# EAGLE design zero_board (EAGLE 9.6.2)
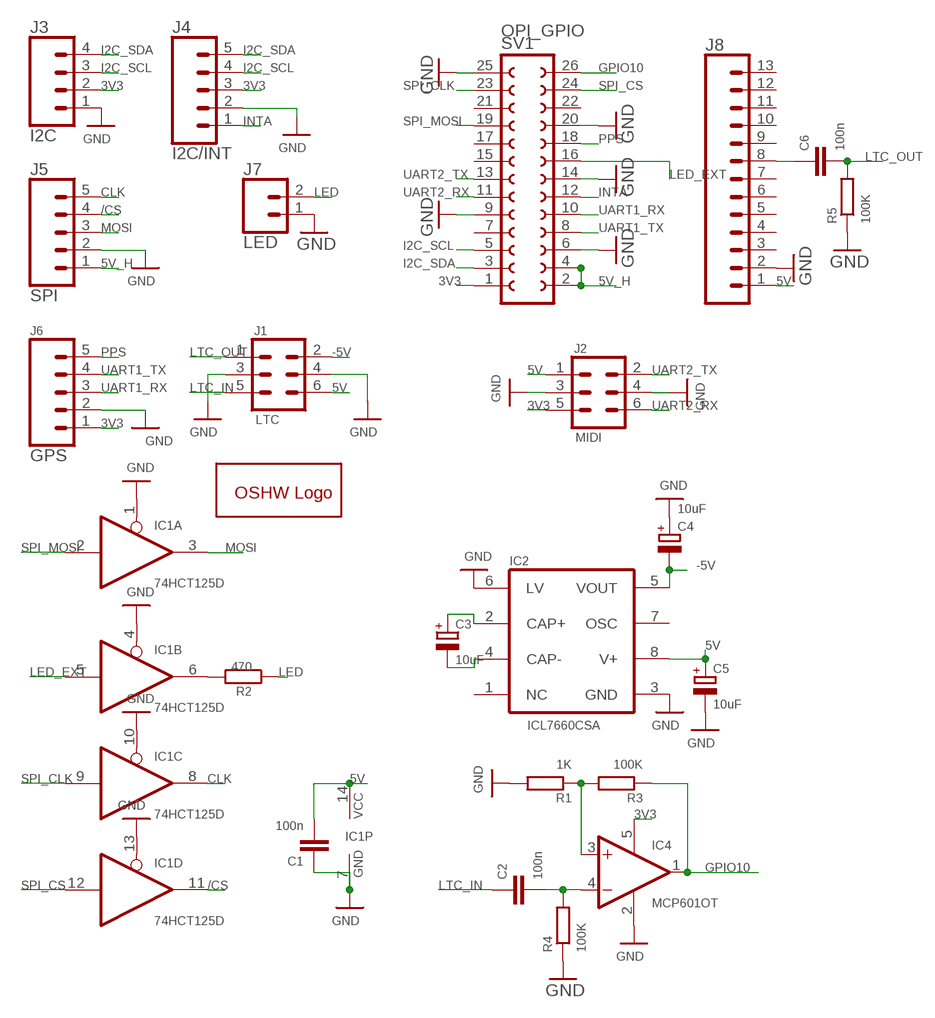
[diagram p0: schematic, sheet 1]

## Parts
C1  100n  C-EUC0603  [C0603]
C2  100n  C-EUC0603  [C0603]
C3  10uF  CPOL-EU153CLV-0405  [153CLV-0405]
C4  10uF  CPOL-EU153CLV-0405  [153CLV-0405]
C5  10uF  CPOL-EU153CLV-0405  [153CLV-0405]
C6  100n  C-EUC0603  [C0603]
GOLD_ORB_SM1  OSHWLOGOLOGO5MM  [OSHW_5MM]
IC1  74HCT125D  [SO14]
IC2  ICL7660CSA  [SO08]
IC4  MCP601OT  [SOT23-5]
J1  LTC  CONN_03X22X3_SILK_MALE_PTH  [2X3]
J2  MIDI  CONN_03X2SHROUD  [2X3-SHROUDED]
J3  I2C  CONN_04  [1X04]
J4  I2C/INT  CONN_05  [1X05]
J5  SPI  CONN_05  [1X05]
J6  GPS  CONN_05  [1X05]
J7  LED  CONN_02  [1X02]
J8  CONN_13  [1X13]
R1  1K  R-EU_R0603  [R0603]
R2  470  R-EU_R0603  [R0603]
R3  100K  R-EU_R0603  [R0603]
R4  100K  R-EU_R0603  [R0603]
R5  100K  R-EU_R0603  [R0603]
SV1  OPI_GPIO  FE13-2  [FE13-2]

## Nets
3V3: IC4.5(V+) J2.5 J3.2 J4.3 J6.1 SV1.1
5V: C1.2 C5.+ IC1.14(P:VCC) IC2.8(V+) J1.6 J2.1 J8.1
5V_H: J5.1 SV1.2 SV1.4
-5V: C4.- IC2.5(VOUT) J1.2
/CS: IC1.11(D:O) J5.4
CLK: IC1.8(C:O) J5.5
GND: C1.1 C4.+ C5.- IC1.1(A:OE) IC1.4(B:OE) IC1.7(P:GND) IC1.10(C:OE) IC1.13(D:OE) IC2.3(GND) IC2.6(LV) IC4.2(V-) J1.3 J1.4 J2.3 J2.4 J3.1 J4.2 J5.2 J6.2 J7.1 J8.2 R1.2 R4.1 R5.1 SV1.6 SV1.9 SV1.14 SV1.20 SV1.25
GPIO10: IC4.1(OUT) R3.1 SV1.26
I2C_SCL: J3.3 J4.4 SV1.5
I2C_SDA: J3.4 J4.5 SV1.3
INTA: J4.1 SV1.12
LED: J7.2 R2.1
LED_EXT: IC1.5(B:I) SV1.16
LINE_OUT_L: C6.1 J8.8
LTC_IN: C2.1 J1.5
LTC_OUT: C6.2 J1.1 R5.2
MOSI: IC1.3(A:O) J5.3
N$1: IC1.6(B:O) R2.2
N$5: C2.2 IC4.4(-IN) R4.2
N$6: IC4.3(+IN) R1.1 R3.2
N$40: C3.+ IC2.2(CAP+)
N$41: C3.- IC2.4(CAP-)
PPS: J6.5 SV1.18
SPI_CLK: IC1.9(C:I) SV1.23
SPI_CS: IC1.12(D:I) SV1.24
SPI_MOSI: IC1.2(A:I) SV1.19
UART1_RX: J6.3 SV1.10
UART1_TX: J6.4 SV1.8
UART2_RX: J2.6 SV1.11
UART2_TX: J2.2 SV1.13
Unconnected: IC2.1(NC) IC2.7(OSC) J8.3 J8.4 J8.5 J8.6 J8.7 J8.9 J8.10 J8.11 J8.12 J8.13 SV1.7 SV1.15 SV1.17 SV1.21 SV1.22

## Library data of the parts
C1 C2 C6 = rcl:C-EU: CAPACITOR, European symbol; SPICEPREFIX: C
C3-C5 = resistor:CPOL-EU: POLARIZED CAPACITOR, European symbol
GOLD_ORB_SM1 = oshw:OSHWLOGO: The OSHW logo for PCB layout
IC1 = 74xx-eu:74*125: Quad bus BUFFER, 3-state
IC2 = maxim:ICL7660CSA: VOLTAGE CONVERTER; MF: MAXIM; MPN: ICL7660CSA; OC_FARNELL: 9724710; OC_NEWARK: 34C3732
IC4 = linear:MCP601: Single Op Amp 2.7V to 6.0V Single Supply CMOS Source: http://ww1.microchip.com/downloads/en/DeviceDoc/21314g.pdf
J1 = SparkFun-Connectors:CONN_03X2: Multi connection point. Often used as Generic Header-pin footprint for 0.1 inch spaced/style header connections You can populate with any combo of single row headers, but if you'd like an exact match, check these: Header - 2x3 (Male, 0.1") <https://www.sparkfun.com/products/12807> (PRT-12807) Header - 2x3 (Female, 0.1") <https://www.sparkfun.com/products/13010> (PRT-13010) 2x3 Pin Shrouded Header <https://www.sparkfun.com/products/10877> (PRT-10877) On any of the 0.1 inch spaced packages, you can populate with these: Break Away Headers - Straight <https://www.sparkfun.com/products/116> (PRT-00116) Break Away Male Headers - Right Angle <https://www.sparkfun.com/products/553> (PRT-00553) Female Headers <https://www.sparkfun.com/products/115> (PRT-00115) Break Away Headers - Machine Pin <https://www.sparkfun.com/products/117> (PRT-00117) Break Away Female Headers - Swiss Machine Pin <https://www.sparkfun.com/products/743> (PRT-00743) Special note: the shrouded connector mates well with our 3x2 ribbon cables: Ribbon Crimp Connector - 6-pin (2x3, Female) <https://www.sparkfun.com/products/10651> (PRT-10651) Ribbon Cable - 6 wire (15ft) <https://www.sparkfun.com/products/10646> (PRT-10646); PROD_ID: CONN-09701
J2 = SparkFun-Connectors:CONN_03X2: Multi connection point. Often used as Generic Header-pin footprint for 0.1 inch spaced/style header connections You can populate with any combo of single row headers, but if you'd like an exact match, check these: Header - 2x3 (Male, 0.1") <https://www.sparkfun.com/products/12807> (PRT-12807) Header - 2x3 (Female, 0.1") <https://www.sparkfun.com/products/13010> (PRT-13010) 2x3 Pin Shrouded Header <https://www.sparkfun.com/products/10877> (PRT-10877) On any of the 0.1 inch spaced packages, you can populate with these: Break Away Headers - Straight <https://www.sparkfun.com/products/116> (PRT-00116) Break Away Male Headers - Right Angle <https://www.sparkfun.com/products/553> (PRT-00553) Female Headers <https://www.sparkfun.com/products/115> (PRT-00115) Break Away Headers - Machine Pin <https://www.sparkfun.com/products/117> (PRT-00117) Break Away Female Headers - Swiss Machine Pin <https://www.sparkfun.com/products/743> (PRT-00743) Special note: the shrouded connector mates well with our 3x2 ribbon cables: Ribbon Crimp Connector - 6-pin (2x3, Female) <https://www.sparkfun.com/products/10651> (PRT-10651) Ribbon Cable - 6 wire (15ft) <https://www.sparkfun.com/products/10646> (PRT-10646); PROD_ID: CONN-10681; SF_ID: PRT_10877
J3 = SparkFun-Connectors:CONN_04: Multi connection point. Often used as Generic Header-pin footprint for 0.1 inch spaced/style header connections On any of the 0.1 inch spaced packages, you can populate with these: Break Away Headers - Straight <https://www.sparkfun.com/products/116> (PRT-00116) Break Away Male Headers - Right Angle <https://www.sparkfun.com/products/553> (PRT-00553) Female Headers <https://www.sparkfun.com/products/115> (PRT-00115) Break Away Headers - Machine Pin <https://www.sparkfun.com/products/117> (PRT-00117) Break Away Female Headers - Swiss Machine Pin <https://www.sparkfun.com/products/743> (PRT-00743) For SCREWTERMINALS and SPRING TERMINALS visit here: Screw Terimnals on SparkFun.com <https://www.sparkfun.com/search/results?term=Screw+Terminals> (5mm/3.5mm/2.54mm spacing) This device is also useful as a general connection point to wire up your design to another part of your project. Our various solder wires solder well into these plated through hole pads. Hook-Up Wire - Assortment (Stranded, 22 AWG) <https://www.sparkfun.com/products/11375> (PRT-11375) Hook-Up Wire - Assortment (Solid Core, 22 AWG) <https://www.sparkfun.com/products/11367> (PRT-11367) View the entire wire category on our website here <https://www.sparkfun.com/categories/141> Special notes: Molex polarized connector foot print use with SKU : PRT-08231 with associated crimp pins and housings. 1MM SMD Version SKU: PRT-10208; PROD_ID: CONN-09696
J4-J6 = SparkFun-Connectors:CONN_05: Multi connection point. Often used as Generic Header-pin footprint for 0.1 inch spaced/style header connections On any of the 0.1 inch spaced packages, you can populate with these: Break Away Headers - Straight <https://www.sparkfun.com/products/116> (PRT-00116) Break Away Male Headers - Right Angle <https://www.sparkfun.com/products/553> (PRT-00553) Female Headers <https://www.sparkfun.com/products/115> (PRT-00115) Break Away Headers - Machine Pin <https://www.sparkfun.com/products/117> (PRT-00117) Break Away Female Headers - Swiss Machine Pin <https://www.sparkfun.com/products/743> (PRT-00743) For SCREWTERMINALS and SPRING TERMINALS visit here: Screw Terimnals on SparkFun.com <https://www.sparkfun.com/search/results?term=Screw+Terminals> (5mm/3.5mm/2.54mm spacing) This device is also useful as a general connection point to wire up your design to another part of your project. Our various solder wires solder well into these plated through hole pads. Hook-Up Wire - Assortment (Stranded, 22 AWG) <https://www.sparkfun.com/products/11375> (PRT-11375) Hook-Up Wire - Assortment (Solid Core, 22 AWG) <https://www.sparkfun.com/products/11367> (PRT-11367) View the entire wire category on our website here <https://www.sparkfun.com/categories/141> Special notes: Molex polarized connector foot print use with SKU : PRT-08231 with associated crimp pins and housings. 1MM SMD Version SKU: PRT-10208
J7 = SparkFun-Connectors:CONN_02: Multi connection point. Often used as Generic Header-pin footprint for 0.1 inch spaced/style header connections On any of the 0.1 inch spaced packages, you can populate with these: Break Away Headers - Straight <https://www.sparkfun.com/products/116> (PRT-00116) Break Away Male Headers - Right Angle <https://www.sparkfun.com/products/553> (PRT-00553) Female Headers <https://www.sparkfun.com/products/115> (PRT-00115) Break Away Headers - Machine Pin <https://www.sparkfun.com/products/117> (PRT-00117) Break Away Female Headers - Swiss Machine Pin <https://www.sparkfun.com/products/743> (PRT-00743) For SCREWTERMINALS and SPRING TERMINALS visit here: Screw Terimnals on SparkFun.com <https://www.sparkfun.com/search/results?term=Screw+Terminals> (5mm/3.5mm/2.54mm spacing) This device is also useful as a general connection point to wire up your design to another part of your project. Our various solder wires solder well into these plated through hole pads. Hook-Up Wire - Assortment (Stranded, 22 AWG) <https://www.sparkfun.com/products/11375> (PRT-11375) Hook-Up Wire - Assortment (Solid Core, 22 AWG) <https://www.sparkfun.com/products/11367> (PRT-11367) View the entire wire category on our website here <https://www.sparkfun.com/categories/141> Special notes: Molex polarized connector foot print use with: PRT-08233 with associated crimp pins and housings. 2.54_SCREWTERM for use with PRT-10571. 3.5mm Screw Terminal footprints for PRT-08084 5mm Screw Terminal footprints for use with PRT-08432
J8 = SparkFun-Connectors:CONN_13: Multi connection point. Often used as Generic Header-pin footprint for 0.1 inch spaced/style header connections On any of the 0.1 inch spaced packages, you can populate with these: Break Away Headers - Straight <https://www.sparkfun.com/products/116> (PRT-00116) Break Away Male Headers - Right Angle <https://www.sparkfun.com/products/553> (PRT-00553) Female Headers <https://www.sparkfun.com/products/115> (PRT-00115) Break Away Headers - Machine Pin <https://www.sparkfun.com/products/117> (PRT-00117) Break Away Female Headers - Swiss Machine Pin <https://www.sparkfun.com/products/743> (PRT-00743) For SCREWTERMINALS and SPRING TERMINALS visit here: Screw Terimnals on SparkFun.com <https://www.sparkfun.com/search/results?term=Screw+Terminals> (5mm/3.5mm/2.54mm spacing) This device is also useful as a general connection point to wire up your design to another part of your project. Our various solder wires solder well into these plated through hole pads. Hook-Up Wire - Assortment (Stranded, 22 AWG) <https://www.sparkfun.com/products/11375> (PRT-11375) Hook-Up Wire - Assortment (Solid Core, 22 AWG) <https://www.sparkfun.com/products/11367> (PRT-11367) View the entire wire category on our website here <https://www.sparkfun.com/categories/141> Special notes: Molex polarized connector foot print use with SKU : PRT-08231 with associated crimp pins and housings. 1MM SMD Version SKU: PRT-10208 NOTES ON THE VARIANTS LOCK and LOCK_LONGPADS... This footprint was designed to help hold the alignment of a through-hole component (i.e. 6-pin header) while soldering it into place. You may notice that each hole has been shifted either up or down by 0.005 of an inch from it's more standard position (which is a perfectly straight line). This slight alteration caused the pins (the squares in the middle) to touch the edges of the holes. Because they are alternating, it causes a "brace" to hold the component in place. 0.005 has proven to be the perfect amount of "off-center" position when using our standard breakaway headers. Although looks a little odd when you look at the bare footprint, once you have a header in there, the alteration is very hard to notice. Also,if you push a header all the way into place, it is covered up entirely on the bottom side.
R1-R5 = rcl:R-EU_: RESISTOR, European symbol
SV1 = con-lsta:FE13-2: FEMALE HEADER; OC_FARNELL: unknown; OC_NEWARK: unknown

## Board
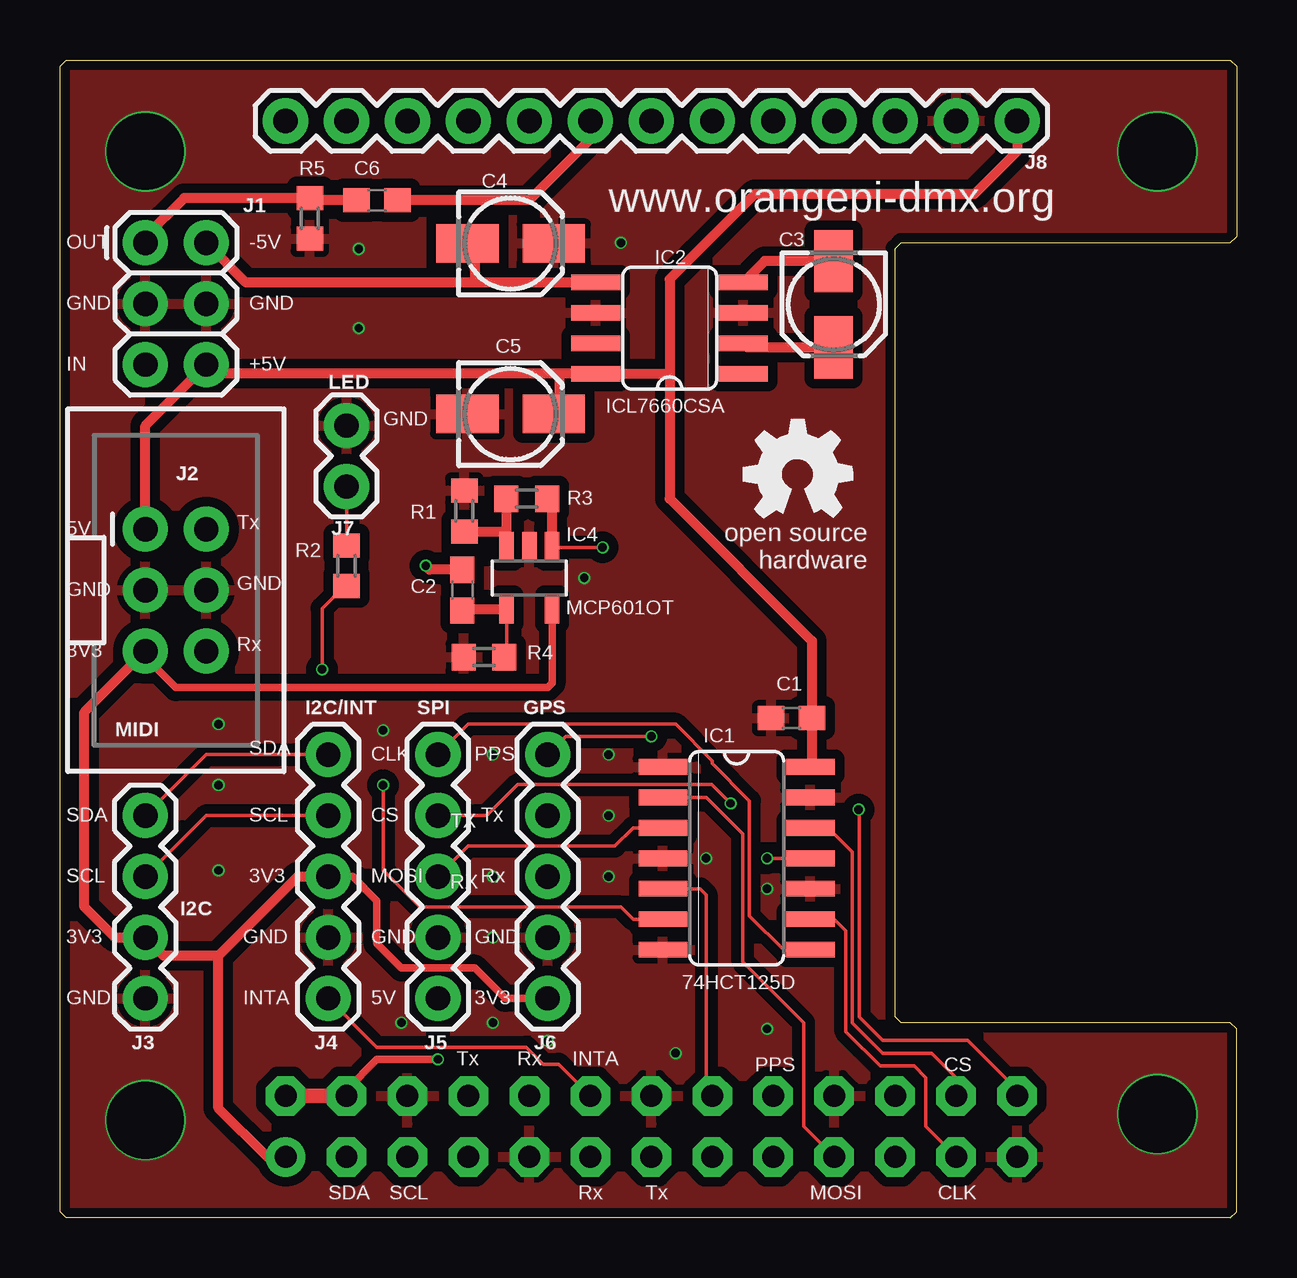
[diagram p1: board, top side]
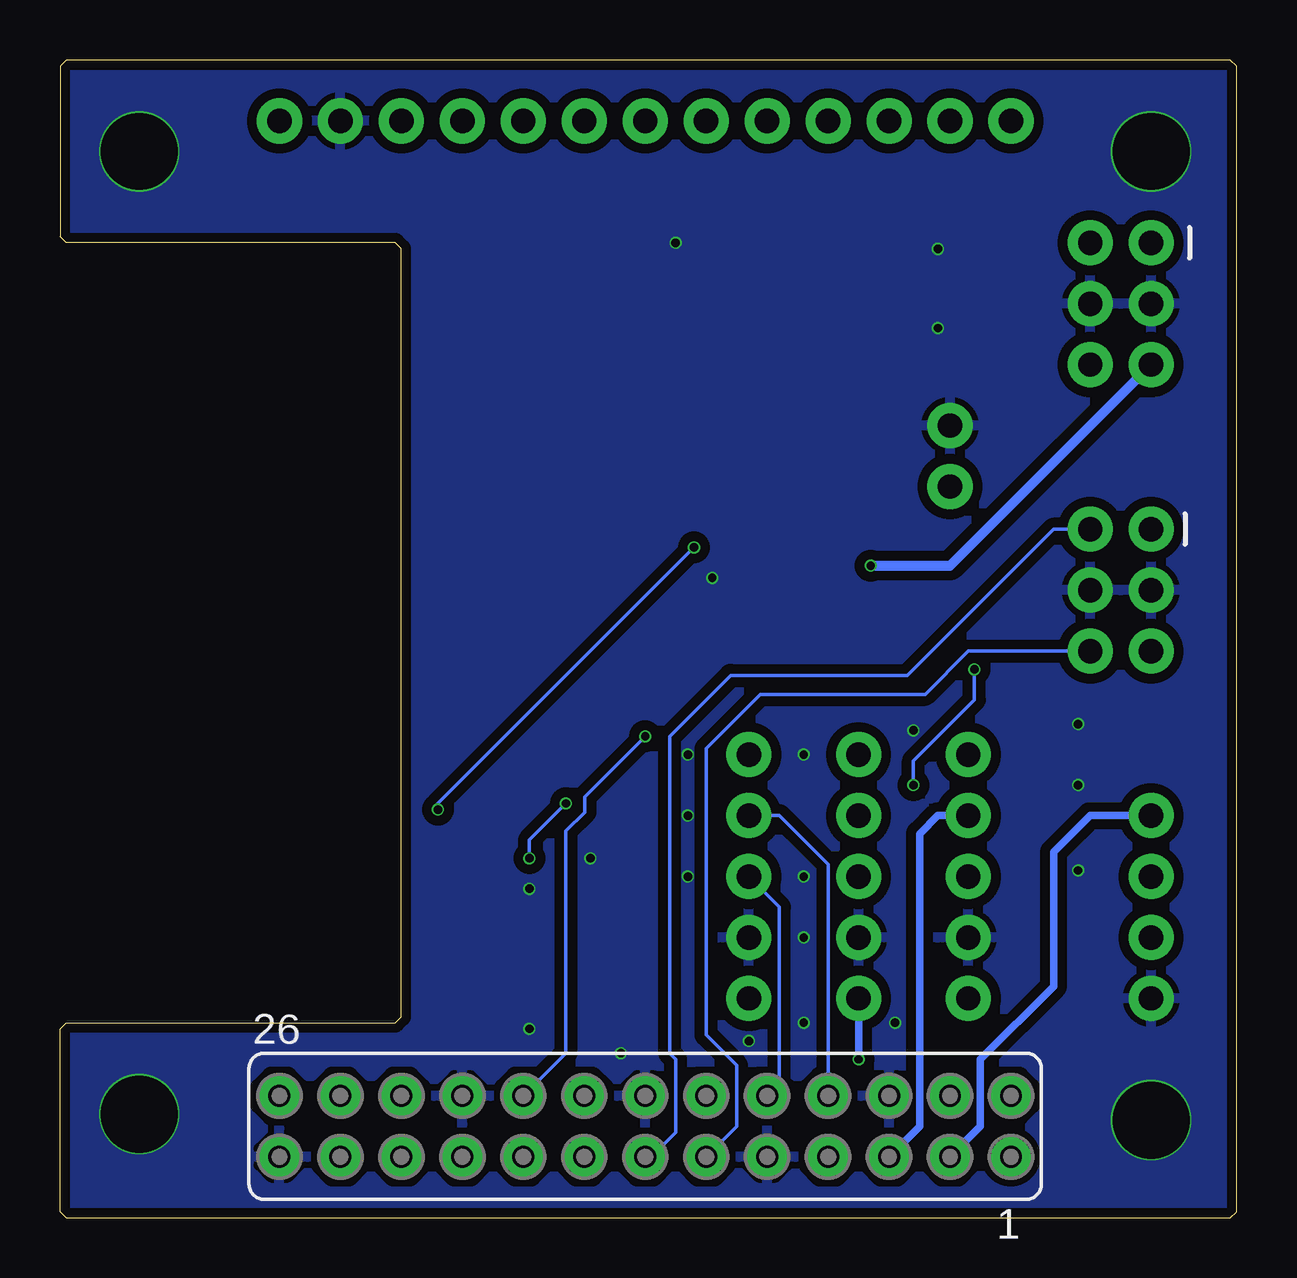
[diagram p2: board, bottom side, seen from below]

Size 49.02 x 48.26 mm. Coordinates in mm from the lower left corner, seen from the top.
Outline: 48.77,0 0.25,0 0,0.25 0,48.01 0.25,48.26 48.77,48.26 49.02,48.01 49.02,40.89 48.77,40.64 35.05,40.64 34.8,40.39 34.8,8.38 35.05,8.13 48.77,8.13 49.02,7.87 49.02,0.25 48.77,0
Copper layers (1*16): Top 0.035mm / dielectric 1.6mm / Bottom 0.035mm
Design rules "jlcpcb-2layers": minimum track width 5mil, minimum drill 0.3mm, track to track 5mil, track to pad 5mil, pad to pad 5mil, via to via 5mil, smd to smd 5mil, copper to edge 0.2mm, drill to drill 6mil, minimum pad ring 10mil, minimum via ring 3mil, stop-mask expansion 4mil, vias tented up to drill 0mil, thermal gap 10mil

### Footprints (pad centres in the part's own frame; a part is rotated, then mirrored left to right if it is on the bottom)
C0603 = smd 1.1 x 1: 1 -0.85,0; 2 0.85,0
153CLV-0405 = smd 2.6 x 1.6: + 1.8,0; - -1.8,0
SO14 = smd 0.66 x 2.032: 1 -3.81,-3.073; 2 -2.54,-3.073; 3 -1.27,-3.073; 4 0,-3.073; 5 1.27,-3.073; 6 2.54,-3.073; 7 3.81,-3.073; 8 3.81,3.073; 9 2.54,3.073; 10 1.27,3.073; 11 0,3.073; 12 -1.27,3.073; 13 -2.54,3.073; 14 -3.81,3.073
SO08 = smd 0.66 x 2.032: 1 -1.905,-3.073; 2 -0.635,-3.073; 3 0.635,-3.073; 4 1.905,-3.073; 5 1.905,3.073; 6 0.635,3.073; 7 -0.635,3.073; 8 -1.905,3.073
SOT23-5 = smd 0.6 x 1.2: 1 -0.95,-1.306; 2 0,-1.306; 3 0.95,-1.306; 4 0.95,1.306; 5 -0.95,1.306
2X3 = drill 1.016 pad 1.88: 1 0,0; 2 0,2.54; 3 2.54,0; 4 2.54,2.54; 5 5.08,0; 6 5.08,2.54
2X3-SHROUDED = drill 1.016 pad 1.88: 1 -1.27,2.54; 2 1.27,2.54; 3 -1.27,0; 4 1.27,0; 5 -1.27,-2.54; 6 1.27,-2.54
1X04 = drill 1.016 pad 1.88: 1 0,0; 2 2.54,0; 3 5.08,0; 4 7.62,0
1X05 = drill 1.016 pad 1.88: 1 0,0; 2 2.54,0; 3 5.08,0; 4 7.62,0; 5 10.16,0
1X02 = drill 1.016 pad 1.88: 1 0,0; 2 2.54,0
1X13 = drill 1.016 pad 1.88: 1 0,0; 2 2.54,0; 3 5.08,0; 4 7.62,0; 5 10.16,0; 6 12.7,0; 7 15.24,0; 8 17.78,0; 9 20.32,0; 10 22.86,0; 11 25.4,0; 12 27.94,0; 13 30.48,0
R0603 = smd 1 x 1.1: 1 -0.85,0; 2 0.85,0
FE13-2 = drill 0.914: 1 -15.24,1.27 | drill 0.914 octagon: 2 -15.24,-1.27; 3 -12.7,1.27; 4 -12.7,-1.27; 5 -10.16,1.27; 6 -10.16,-1.27; 7 -7.62,1.27; 8 -7.62,-1.27; 9 -5.08,1.27; 10 -5.08,-1.27; 11 -2.54,1.27; 12 -2.54,-1.27; 13 0,1.27; 14 0,-1.27; 15 2.54,1.27; 16 2.54,-1.27; 17 5.08,1.27; 18 5.08,-1.27; 19 7.62,1.27; 20 7.62,-1.27; 21 10.16,1.27; 22 10.16,-1.27; 23 12.7,1.27; 24 12.7,-1.27; 25 15.24,1.27; 26 15.24,-1.27

### Placement (x,y rotation side)
C1  30.48,20.83 0 top
C2  16.76,26.16 270 top
C3  32.24,38.07 270 top
C4  18.77,40.61 0 top
C5  18.77,33.5 0 top
C6  13.21,42.42 180 top
GOLD_ORB_SM1  30.73,30.99 0 top
IC1  28.19,14.99 270 top
IC2  25.4,37.08 90 top
IC4  19.56,26.67 180 top
J1  3.56,40.64 270 top
J2  4.83,26.16 0 top
J3  3.56,9.14 90 top
J4  11.18,9.14 90 top
J5  15.75,9.14 90 top
J6  20.32,9.14 90 top
J7  11.94,33.02 270 top
J8  39.88,45.72 180 top
R1  16.85,29.46 90 top
R2  11.94,27.18 270 top
R3  19.45,29.97 180 top
R4  17.67,23.37 0 top
R5  10.41,41.66 90 top
SV1  24.64,3.81 180 bottom

### Tracks (layer width: path | path; a pad name or v marks a point on that pad's centre or on a via)
3V3
  Top 0.305: J6.1 18.54,9.14 17.27,10.41 14.22,10.41 13.21,11.43 13.21,13.21 12.19,14.22 J4.3 | IC4.5 20.51,22.29 20.32,22.1 4.83,22.1 3.56,23.37 J2.5
  Top 0.406: 6.6,10.92 9.91,14.22 J4.3 | SV1.1 8.64,2.54 6.6,4.57 6.6,10.92 | 6.6,10.92 4.32,10.92 J3.2 2.29,11.68 1.02,12.95 1.02,21.08 J2.5
5V
  Top 0.152: 31.33,18.86 IC1.14
  Top 0.406: 31.33,18.86 C1.2 31.33,24.04 25.4,29.97 25.4,35.31 | 25.4,35.31 25.4,39.12 28.96,42.67 38.1,42.67 39.88,44.45 J8.1 | 20.83,35.18 IC2.8 25.27,35.18 25.4,35.31 | 20.83,35.18 6.48,35.18 J1.6 3.56,33.02 J2.1 | C5.+ 20.83,33.76 20.83,35.18
5V_H  (via drill 0.35)
  Top 0.305: SV1.4 11.94,5.33 13.21,6.6 v15.75,6.6
  Top 0.61: SV1.4 SV1.2
  Bottom 0.305: v15.75,6.6 J5.1
-5V
  Top 0.406: IC2.5 17.27,38.99 | 17.27,38.99 7.75,38.99 J1.2 | C4.- 17.27,40.32 17.27,38.99
/CS  (via drill 0.35)
  Top 0.152: v29.46,14.99 IC1.11 | J5.4 17.78,16.76 19.07,18.06 27.15,18.06 v27.94,17.27
  Bottom 0.152: v27.94,17.27 29.46,15.75 v29.46,14.99
CLK
  Top 0.152: IC1.8 31.24,11.15 30.17,11.15 28.73,12.59 28.73,17.38 27.18,18.93 27.18,19.05 25.65,20.57 17.02,20.57 J5.5
GND  (via drill 0.35, 3.2)
  other vias: 3.56,4.06 45.72,4.32 3.56,44.45 45.72,44.45 6.6,14.48 6.6,18.03 25.65,6.86 22.86,16.76 22.86,19.3 21.84,26.67 20.32,7.37 12.45,37.08 6.6,20.57 22.86,14.22 29.46,7.87 29.46,13.72 26.92,14.99 18.03,11.68 14.22,8.13 18.03,8.13 18.03,14.22 13.46,20.32 18.03,19.3 12.45,40.39 23.37,40.64
  pour Bottom (isolate 0.406): 49.78,-1.02 -1.27,-1.02 -1.27,49.53 49.53,49.53 49.53,40.13 36.07,40.13 36.07,8.64 49.78,8.64
  pour Top (isolate 0.406): 49.78,-1.02 49.78,8.64 36.07,8.64 36.07,40.13 49.53,40.13 49.53,49.53 -1.27,49.53 -1.27,-1.02
GPIO10  (via drill 0.35)
  Top 0.152: 20.51,29.76 R3.1 | IC4.1 20.54,27.94 v22.61,27.94 | v33.27,17.02 33.3,17.02 33.3,8.38 34.29,7.39 37.82,7.39 39.88,5.33 SV1.26
  Top 0.406: IC4.1 20.51,29.76
  Bottom 0.152: v33.27,17.02 33.27,17.27 v22.61,27.94
I2C_SCL
  Top 0.152: J3.3 6.1,16.76 J4.4
  Bottom 0.305: SV1.5 13.21,3.81 13.21,16 12.45,16.76 J4.4
I2C_SDA
  Top 0.152: J3.4 6.1,19.3 J4.5
  Bottom 0.305: SV1.3 10.67,3.81 10.67,6.6 7.62,9.65 7.62,15.24 6.1,16.76 J3.4
INTA
  Top 0.152: J4.1 13.21,7.11 19.42,7.11 20.13,6.4 20.77,6.4 SV1.12
LED
  Top 0.152: R2.1 J7.2
LED_EXT
  Top 0.152: SV1.16 26.92,5.33 26.92,13.46 26.67,13.72 IC1.5
LINE_OUT_L
  Top 0.406: C6.1 19.56,42.42 22.1,44.96 J8.8
LTC_IN  (via drill 0.35)
  Top 0.406: C2.1 15.41,27.01 v15.24,27.18
  Bottom 0.406: v15.24,27.18 11.94,27.18 J1.5
LTC_OUT
  Top 0.406: C6.2 10.5,42.42 R5.2 5.17,42.51 3.56,40.89 J1.1
MOSI
  Top 0.152: J5.3 17.02,15.49 23.11,15.49 23.88,16.26 IC1.3
N$1  (via drill 0.35)
  Top 0.152: IC1.6 23.88,12.45 23.37,12.95 14.99,12.95 13.46,14.48 v13.46,18.03 | R2.2 11.85,26.33 10.92,25.4 v10.92,22.86
  Bottom 0.152: v13.46,18.03 13.46,19.05 10.92,21.59 v10.92,22.86
N$5
  Top 0.152: 16.82,25.36 C2.2 | IC4.4 18.61,23.46 R4.2
  Top 0.406: IC4.4 16.82,25.36
N$6
  Top 0.152: IC4.3 18.61,28.45 18.44,28.61 | 18.61,29.96 R3.2
  Top 0.406: 18.61,28.45 18.61,29.96 | R1.1 18.44,28.61
N$40
  Top 0.152: 28.65,36.27 IC2.2
  Top 0.406: C3.+ 28.65,36.27
N$41
  Top 0.406: C3.- 29.36,39.88 IC2.4
PPS  (via drill 0.35)
  Top 0.152: v24.64,20.07 21.08,20.07 J6.5
  Bottom 0.152: v24.64,20.07 27.15,17.55 27.15,16.9 27.94,16.11 27.94,6.86 SV1.18
SPI_CLK
  Top 0.152: SV1.23 36.07,3.81 36.07,5.84 35.59,6.33 34.17,6.33 32.74,7.76 32.74,11.96 32.26,12.45 IC1.9
SPI_CS
  Top 0.152: SV1.24 37.34,5.84 36.32,6.86 34.29,6.86 33.02,8.13 33.02,15.24 32,16.26 IC1.12
SPI_MOSI
  Top 0.152: SV1.19 30.99,3.81 30.99,8.13 28.45,10.67 28.45,16 26.92,17.53 IC1.2
UART1_RX
  Bottom 0.152: SV1.10 19.05,5.59 19.05,12.95 J6.3
UART1_TX
  Bottom 0.152: SV1.8 17.02,14.73 19.05,16.76 J6.4
UART2_RX
  Bottom 0.152: J2.6 11.18,23.62 12.98,21.82 19.84,21.82 22.1,19.56 22.1,7.62 20.83,6.35 20.83,3.81 SV1.11
UART2_TX
  Bottom 0.152: J2.2 7.62,28.7 13.72,22.61 21.08,22.61 23.62,20.07 23.62,6.86 23.37,6.6 23.37,3.56 24.38,2.54 SV1.13

### Text on the board
tPlace: www.orangepi-dmx.org | OUT | -5V | GND | GND | IN | +5V | GND | 5V | Tx | GND | GND | 3V3 | Rx | SDA | CLK | PPS | SDA | SCL | CS | TX | Tx | SCL | 3V3 | MOSI | RX | Rx | 3V3 | GND | GND | GND | GND | INTA | 5V | 3V3 | Tx | Rx | INTA | PPS | CS | SDA | SCL | Rx | Tx | MOSI | CLK